# Altium schematic sheet HDC2022.SchDoc
size A4; Organization: Altium Limited; Address1: L3, 12a Rodborough Rd; Address2: Frenchs Forest; Address3: NSW; Address4: Australia 2086; DocumentNumber: 1; Revision: v1.0.0; SheetNumber: 1; SheetTotal: 1
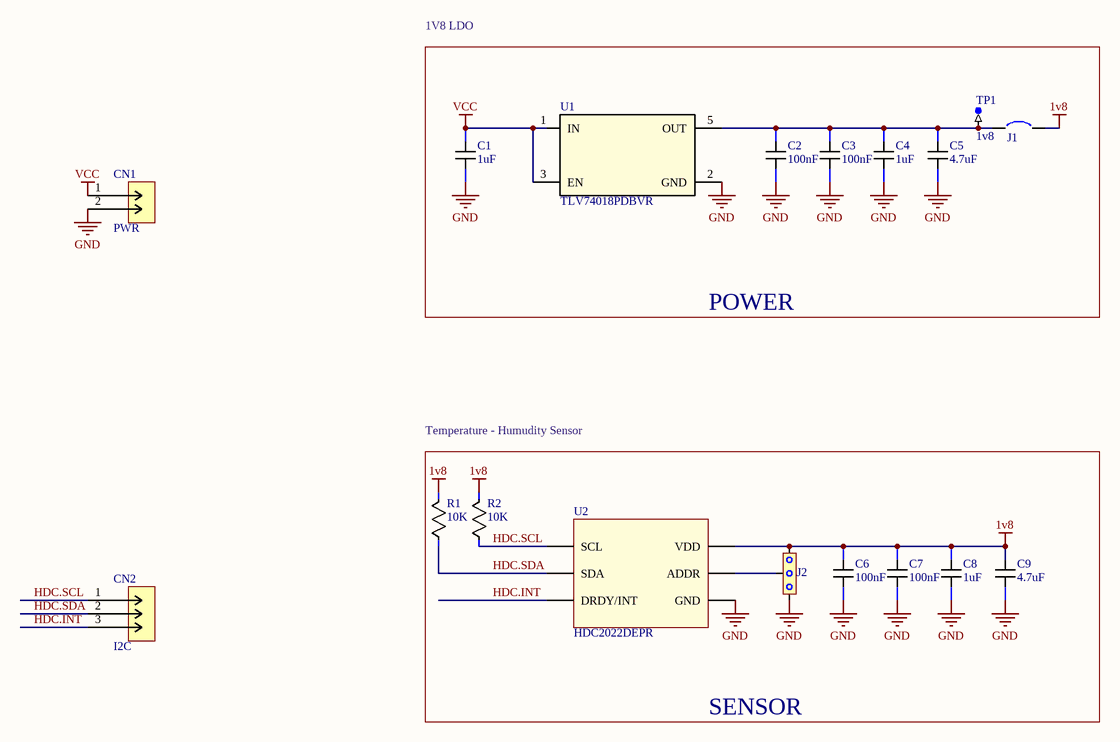
[diagram p0: HDC2022.SchDoc]

## Parts
C1  1uF  [CAP_0805]
C2  100nF  [CAP_0805]
C3  100nF  [CAP_0805]
C4  1uF  [CAP_0805]
C5  4.7uF  [CAP_0805]
C6  100nF  [CAP_0805]
C7  100nF  [CAP_0805]
C8  1uF  [CAP_0805]
C9  4.7uF  [CAP_0805]
CN1  PWR  [HD_2pin_2.54mm_male]
CN2  I2C  [HD_3pin_2.54mm_male]
J1  Jumper  [SB_0603]  (value not drawn)
J2  JUMPER_3Pin  [SB_0603 - 3 Pin]  (value not drawn)
R1  10K  [RES_0805]
R2  10K  [RES_0805]
TP1  1v8  [TP]
U1  TLV74018PDBVR  [SOIC_DBVR_TEX]
U2  HDC2022DEPR  [WSON-6]

## Blocks framed on the sheet
POWER: C1-C5 J1 TP1 U1
SENSOR: C6-C9 J2 R1 R2 U2

## Nets
1v8: C6.2 C7.2 C8.2 C9.2 J1.2 J2.1 R1.2 R2.2 U2.5(VDD)
GND: C1.1 C2.1 C3.1 C4.1 C5.1 C6.1 C7.1 C8.1 C9.1 CN1.2 J2.3 U1.2(GND) U2.2(GND)
VCC: C1.2 CN1.1 U1.1(IN) U1.3(EN)
HDC.INT: CN2.3 U2.4(DRDY/INT)
HDC.SCL: CN2.1 R2.1 U2.6(SCL)
HDC.SDA: CN2.2 R1.1 U2.1(SDA)
NetC2_2: C2.2 C3.2 C4.2 C5.2 J1.1 TP1.1 U1.5(OUT)
NetJ2_2: J2.2 U2.3(ADDR)

Not connected (* = marked no-connect by the designer): U1 4(NC)

## Notes on the sheet
- 1V8 LDO
- Temperature - Humudity Sensor
- Title
- Size:
- Date:
- A4
- Number:
- Time:
- Revision:
- Sheet
- of
- File:

## Library data of the parts
C1-C9 = Capacitor
CN1 = HD_2pin_2.54mm_Male
CN2 = HD_3pin_2.54mm_Male
R1 R2 = Resistor
TP1 = Test Point
U1 = TLV74018PDBVR: Manufacturer: Texas Instruments; Supplier 1: Digi-Key; Manufacturer Part Number: TLV74018PDBVR; RoHS: No; Stock 1: 4366; Pricing 1: 1=0,24000, 10=0,19400, 25=0,16200, 100=0,09000, 250=0,07920, 500=0,06750, 1000=0,04590 (USD); Supplier Part Number 1: 296-TLV74018PDBVRCT-ND
U2 = HDC2022DEPR: Manufacturer: Texas Instruments; Supplier 1: Digi-Key; Manufacturer Part Number: HDC2022DEPR; RoHS: No; Stock 1: 2745; Pricing 1: 1=4,49000, 5=3,96000, 10=3,49800, 25=2,83800, 50=2,50800, 100=2,44200, 500=2,04600, 1000=1,91400 (USD); Supplier Part Number 1: 296-HDC2022DEPRCT-ND
J1 = Jumper: Published: 24-Mar-1999; Revision: July-2002: Re-released for DXP Platform.; Publisher: Altium Limited